# EAGLE design thermostat (EAGLE 5.11)
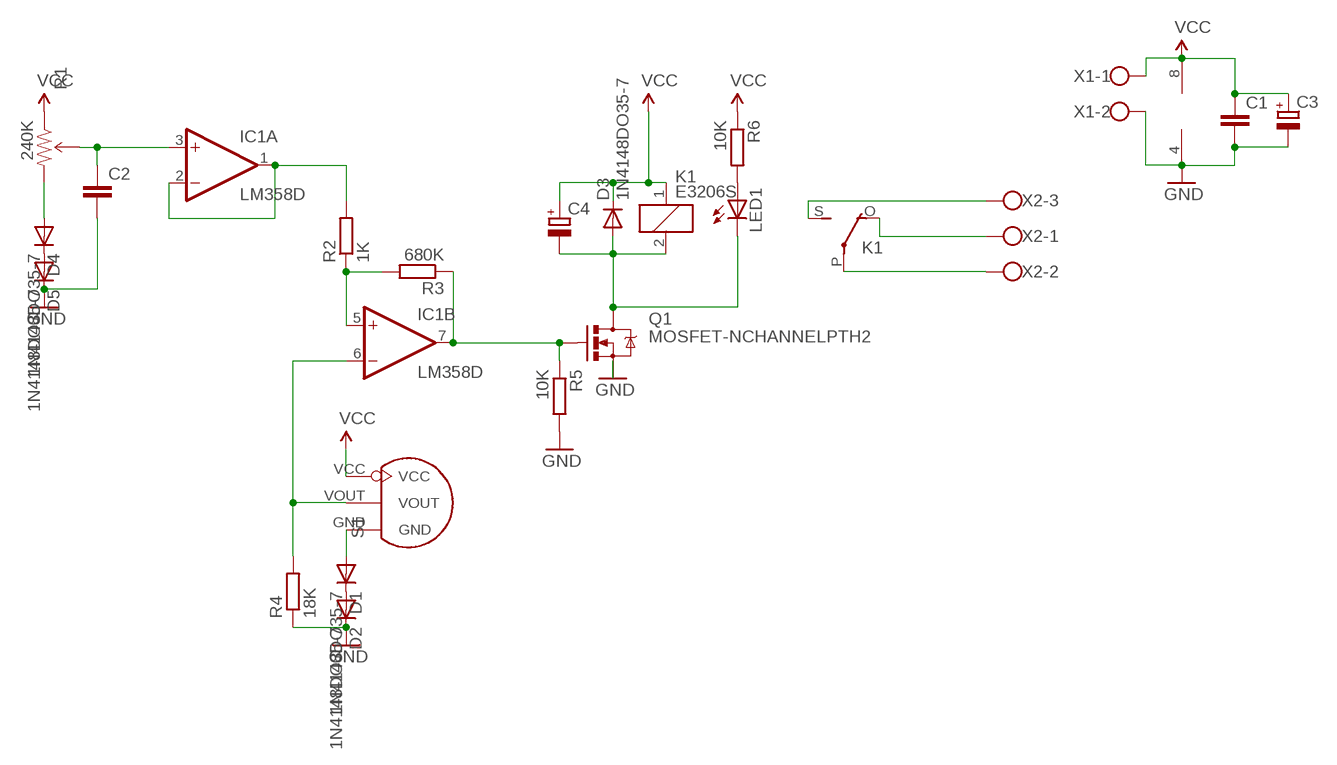
[diagram p0: schematic, sheet 1]

## Parts
C1  C-EUC0805  [C0805]
C2  C-EUC0805  [C0805]
C3  CPOL-EUE5-13  [E5-13]
C4  CPOL-EUE3.5-10  [E3,5-10]
D1  1N4148DO35-7  [DO35-7]
D2  1N4148DO35-7  [DO35-7]
D3  1N4148DO35-7  [DO35-7]
D4  1N4148DO35-7  [DO35-7]
D5  1N4148DO35-7  [DO35-7]
IC1  LM358D  [SO08]
K1  E3206S  [E3206S]
LED1  LED5MM  [LED5MM]
Q1  MOSFET-NCHANNELPTH2  [TO220V]
R1  240K  TRIMPOT  [3362U-2]
R2  1K  R-EU_R0805  [R0805]
R3  680K  R-EU_R0805  [R0805]
R4  18K  R-EU_R0805  [R0805]
R5  10K  R-EU_R0805  [R0805]
R6  10K  R-EU_R0805  [R0805]
S1  SENSOR-LM35  [TO-92]
X1  W237-102  [W237-102]
X2  W237-103  [W237-103]

## Nets
GND: C1.2 C2.2 C3.- D2.C D5.C IC1.4(P:V-) Q1.3(S) R4.1 R5.2 X1.2
N$1: C2.1 IC1.3(A:+IN) R1.2(WIPER)
N$2: IC1.1(A:OUT) IC1.2(A:-IN) R2.2
N$3: IC1.5(B:+IN) R2.1 R3.2
N$4: IC1.7(B:OUT) Q1.1(G) R3.1 R5.1
N$5: D1.C D2.A
N$6: D1.A S1.GND
N$7: IC1.6(B:-IN) R4.2 S1.VOUT
N$8: C4.- D3.A K1.2 LED1.K(C) Q1.2(D)
N$9: K1.P(2:P) X2.2
N$10: K1.O(2:O) X2.1
N$11: K1.S(2:S) X2.3
N$13: LED1.A R6.2
N$14: D4.A R1.3(CW)
N$15: D4.C D5.A
VCC: C1.1 C3.+ C4.+ D3.C IC1.8(P:V+) K1.1 R1.1(CCW) R6.1 S1.VCC X1.1

## Library data of the parts
C1 C2 = rcl:C-EU: CAPACITOR, European symbol
C3 C4 = rcl:CPOL-EU: POLARIZED CAPACITOR, European symbol
D1-D5 = diode:1N4148: DIODE high speed (Philips)
IC1 = linear:LM358: OP AMP also LM158; LM258; LM2904 Source: http://cache.national.com/ds/LM/LM158.pdf
K1 = relay:E3206S: RELAY 1 x switch, Eichhoff/distributor Schukat; OC_FARNELL: unknown; OC_NEWARK: unknown
LED1 = SparkFun:LED: LEDs Standard schematic elements and footprints for 5mm, 3mm, 1206, and 0603 sized LEDs. 5mm - Spark Fun Electronics SKU : COM-00529 (and others)
Q1 = SparkFun:MOSFET-NCHANNEL
R1 = SparkFun:TRIMPOT
R2-R6 = rcl:R-EU_: RESISTOR, European symbol
S1 = Seeed-Discrete:SENSOR-LM35: http://search.digikey.com/scripts/DkSearch/dksus.dll?Detail&name=LM35DZ-ND
X1 = con-wago-500:W237-102: WAGO SCREW CLAMP; MPN: 237-102; OC_FARNELL: unknown; OC_NEWARK: 70K9898
X2 = con-wago-500:W237-103: WAGO SCREW CLAMP; MPN: 237-103; OC_FARNELL: unknown; OC_NEWARK: 18M7116

## Board
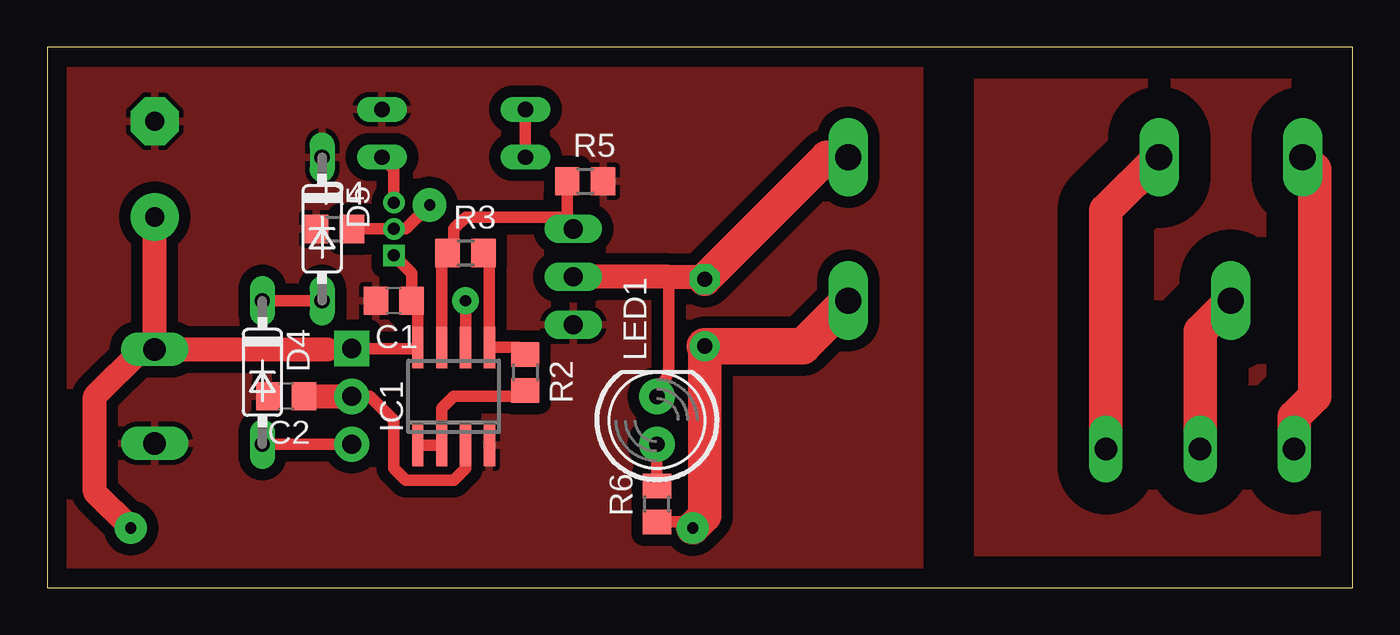
[diagram p1: board, top side]
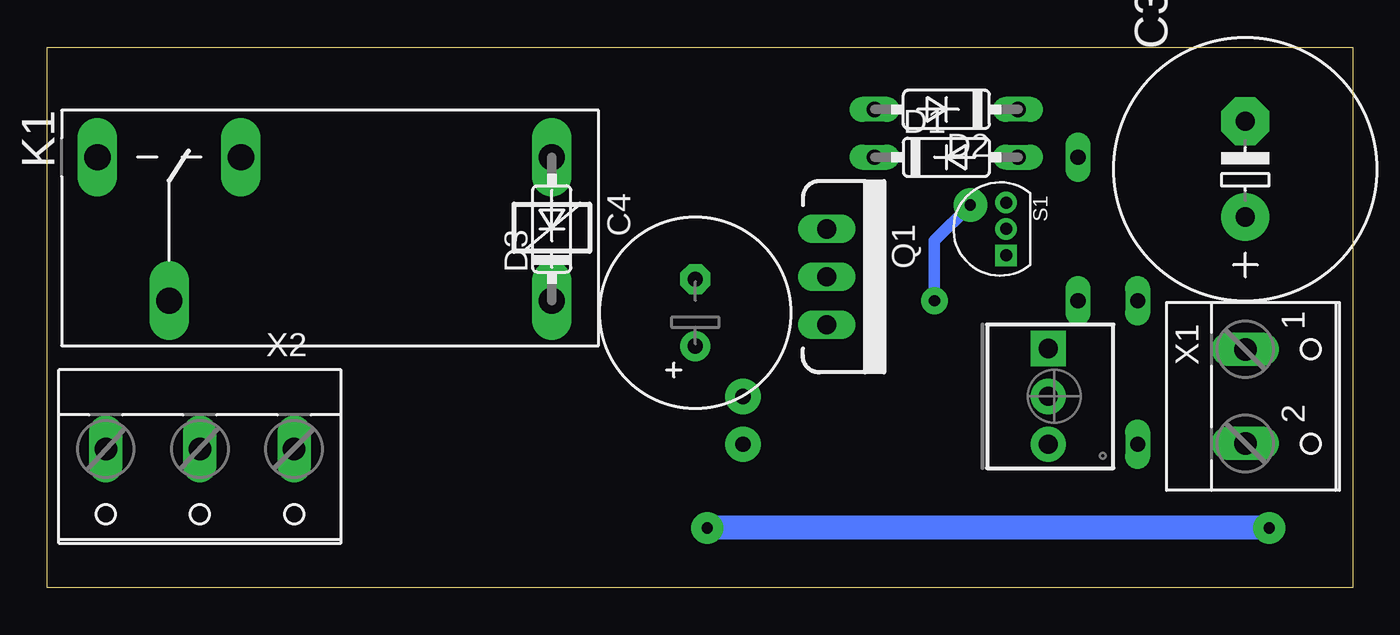
[diagram p2: board, bottom side, seen from below]

Size 69.35 x 28.71 mm. Coordinates in mm from the lower left corner, seen from the top.
Outline: 0,0 69.35,0 69.35,28.71 0,28.71 0,0
Copper layers (1*16): Top 0.035mm / dielectric 1.5mm / Bottom 0.035mm
Design rules "default": minimum track width 10mil, minimum drill 24mil, track to track 8mil, track to pad 8mil, pad to pad 8mil, via to via 8mil, smd to smd 8mil, copper to edge 40mil, drill to drill 8mil, minimum pad ring 10mil, minimum via ring 8mil, stop-mask expansion 4mil, vias tented up to drill 0mil, thermal gap 10mil

### Footprints (pad centres in the part's own frame; a part is rotated, then mirrored left to right if it is on the bottom)
C0805 = smd 1.3 x 1.5: 1 -0.95,0; 2 0.95,0
E5-13 = drill 1.016 pad 2.54 round: + -2.54,0 | drill 1.016 pad 2.54 octagon: - 2.54,0
E3,5-10 = drill 0.813 pad 1.6 round: + -1.778,0 | drill 0.813 pad 1.6 octagon: - 1.778,0
DO35-7 = drill 0.813 long: A 3.81,0; C -3.81,0
SO08 = smd 0.6 x 2.2: 1 -1.905,-2.6; 2 -0.635,-2.6; 3 0.635,-2.6; 4 1.905,-2.6; 5 1.905,2.6; 6 0.635,2.6; 7 -0.635,2.6; 8 -1.905,2.6
E3206S = drill 1.397 long: 1 -3.175,3.81; 2 -3.175,-3.81; O 13.335,-3.81; P 17.145,3.81; S 20.955,-3.81
LED5MM = drill 0.813 pad 1.88 round: A -1.27,0; K 1.27,0
TO220V = drill 1.016 long: 1 -2.54,0; 2 0,0; 3 2.54,0
3362U-2 = drill 1.016 pad 1.88 square: 1 -2.54,-0.305 | drill 1.016 pad 1.88 round: 2 0,-0.305; 3 2.54,-0.305
R0805 = smd 1.3 x 1.5: 1 -0.95,0; 2 0.95,0
TO-92 = drill 0.635 pad 1.143 round: GND -1.397,0; VOUT 0,0 | drill 0.635 pad 1.143 square: VCC 1.397,0
W237-102 = drill 1.194 long: 1 -2.5,-1.27; 2 2.5,-1.27
W237-103 = drill 1.194 long: 1 -6,-2.29; 2 -1,-2.29; 3 4,-2.29

### Placement (x,y rotation side)
C1  18.41,15.24 180 top
C2  12.7,10.16 180 top
C3  5.71,22.23 90 bottom
C4  34.92,14.61 90 bottom
D1  21.59,22.86 0 bottom
D2  21.59,25.4 180 bottom
D3  42.55,19.05 90 bottom
D4  11.43,11.43 270 top
D5  14.61,19.05 270 top
IC1  21.59,10.16 0 top
K1  45.72,19.05 180 bottom
LED1  32.38,8.89 90 top
Q1  27.94,16.51 270 bottom
R1  15.88,10.16 270 bottom
R2  25.4,11.43 270 top
R3  22.23,17.78 0 top
R4  15.24,19.05 0 top
R5  28.57,21.59 0 top
R6  32.38,4.45 90 top
S1  18.41,19.05 270 bottom
X1  4.45,10.16 270 bottom
X2  62.23,5.08 180 bottom

### Tracks (layer width: path | path; a pad name or v marks a point on that pad's centre or on a via)
GND
  pour Top (isolate 0.61): 0,0 46.35,0 46.35,27.94 0,27.94
N$1
  Top 0.61: R1.2 17.14,10.16 18.41,8.89 18.41,6.35 19.05,5.71 21.59,5.71 22.23,6.35 IC1.3
  Top 1.27: C2.1 R1.2
N$2
  Top 0.61: IC1.1 IC1.2 20.95,9.53 21.59,10.16 25.08,10.16 R2.2
N$3
  Top 0.61: R3.2 23.5,17.46 IC1.5 25.02,12.76 R2.1
N$4
  Top 0.61: IC1.7 20.95,17.46 R3.1 21.59,18.09 21.59,19.05 22.23,19.68 27.3,19.68 Q1.1 27.62,19.36 R5.1
N$5
  Top 0.61: D1.C D2.A
N$6
  Top 0.61: S1.GND 18.41,22.23 D1.A
N$7  (via drill 0.6 pad 1.42, 0.6 pad 1.78)
  Top 0.61: v20.32,20.32 19.05,19.05 S1.VOUT R4.2 | v22.23,15.24 IC1.6
  Bottom 0.61: v20.32,20.32 22.23,18.41 v22.23,15.24
N$8
  Top 0.61: LED1.K 33.02,11.43 33.02,16.51
  Top 1.27: Q1.2 33.02,16.51 34.8,16.51 C4.-
  Top 1.778: C4.- 41.4,22.86 K1.2
N$9
  Top 1.778: K1.P 61.23,13.61 X2.2
N$10
  Top 1.778: K1.O 56.23,20.04 X2.1
N$11
  Top 1.778: K1.S 67.31,22.23 67.31,10.16 66.23,9.08 X2.3
N$12
  pour Top (isolate 1.676): 49.53,0 69.85,0 69.85,29.21 49.53,29.21
N$13
  Top 0.61: R6.2 LED1.A
N$14
  Top 0.61: D4.A R1.3
N$15
  Top 0.61: D4.C D5.A
VCC  (via drill 0.6 pad 1.68)
  Top 0.61: 14.87,12.66 R1.1 19.62,12.7 IC1.8 19.68,14.92 C1.1 19.36,16.7 S1.VCC | R6.1 33.97,3.5 v34.29,3.17
  Top 1.27: X1.1 14.87,12.66 | X1.1 C3.+ | v4.45,3.17 2.54,5.08 2.54,10.16 5.08,12.7 6.31,12.7 X1.1
  Top 1.778: v34.29,3.17 34.92,3.81 C4.+
  Top 1.93: C4.+ 40.13,12.83 K1.1
  Bottom 1.27: v4.45,3.17 v34.29,3.17